# Altium project QUTMS-AMU-2021.PrjPcb (part 1 of 3)
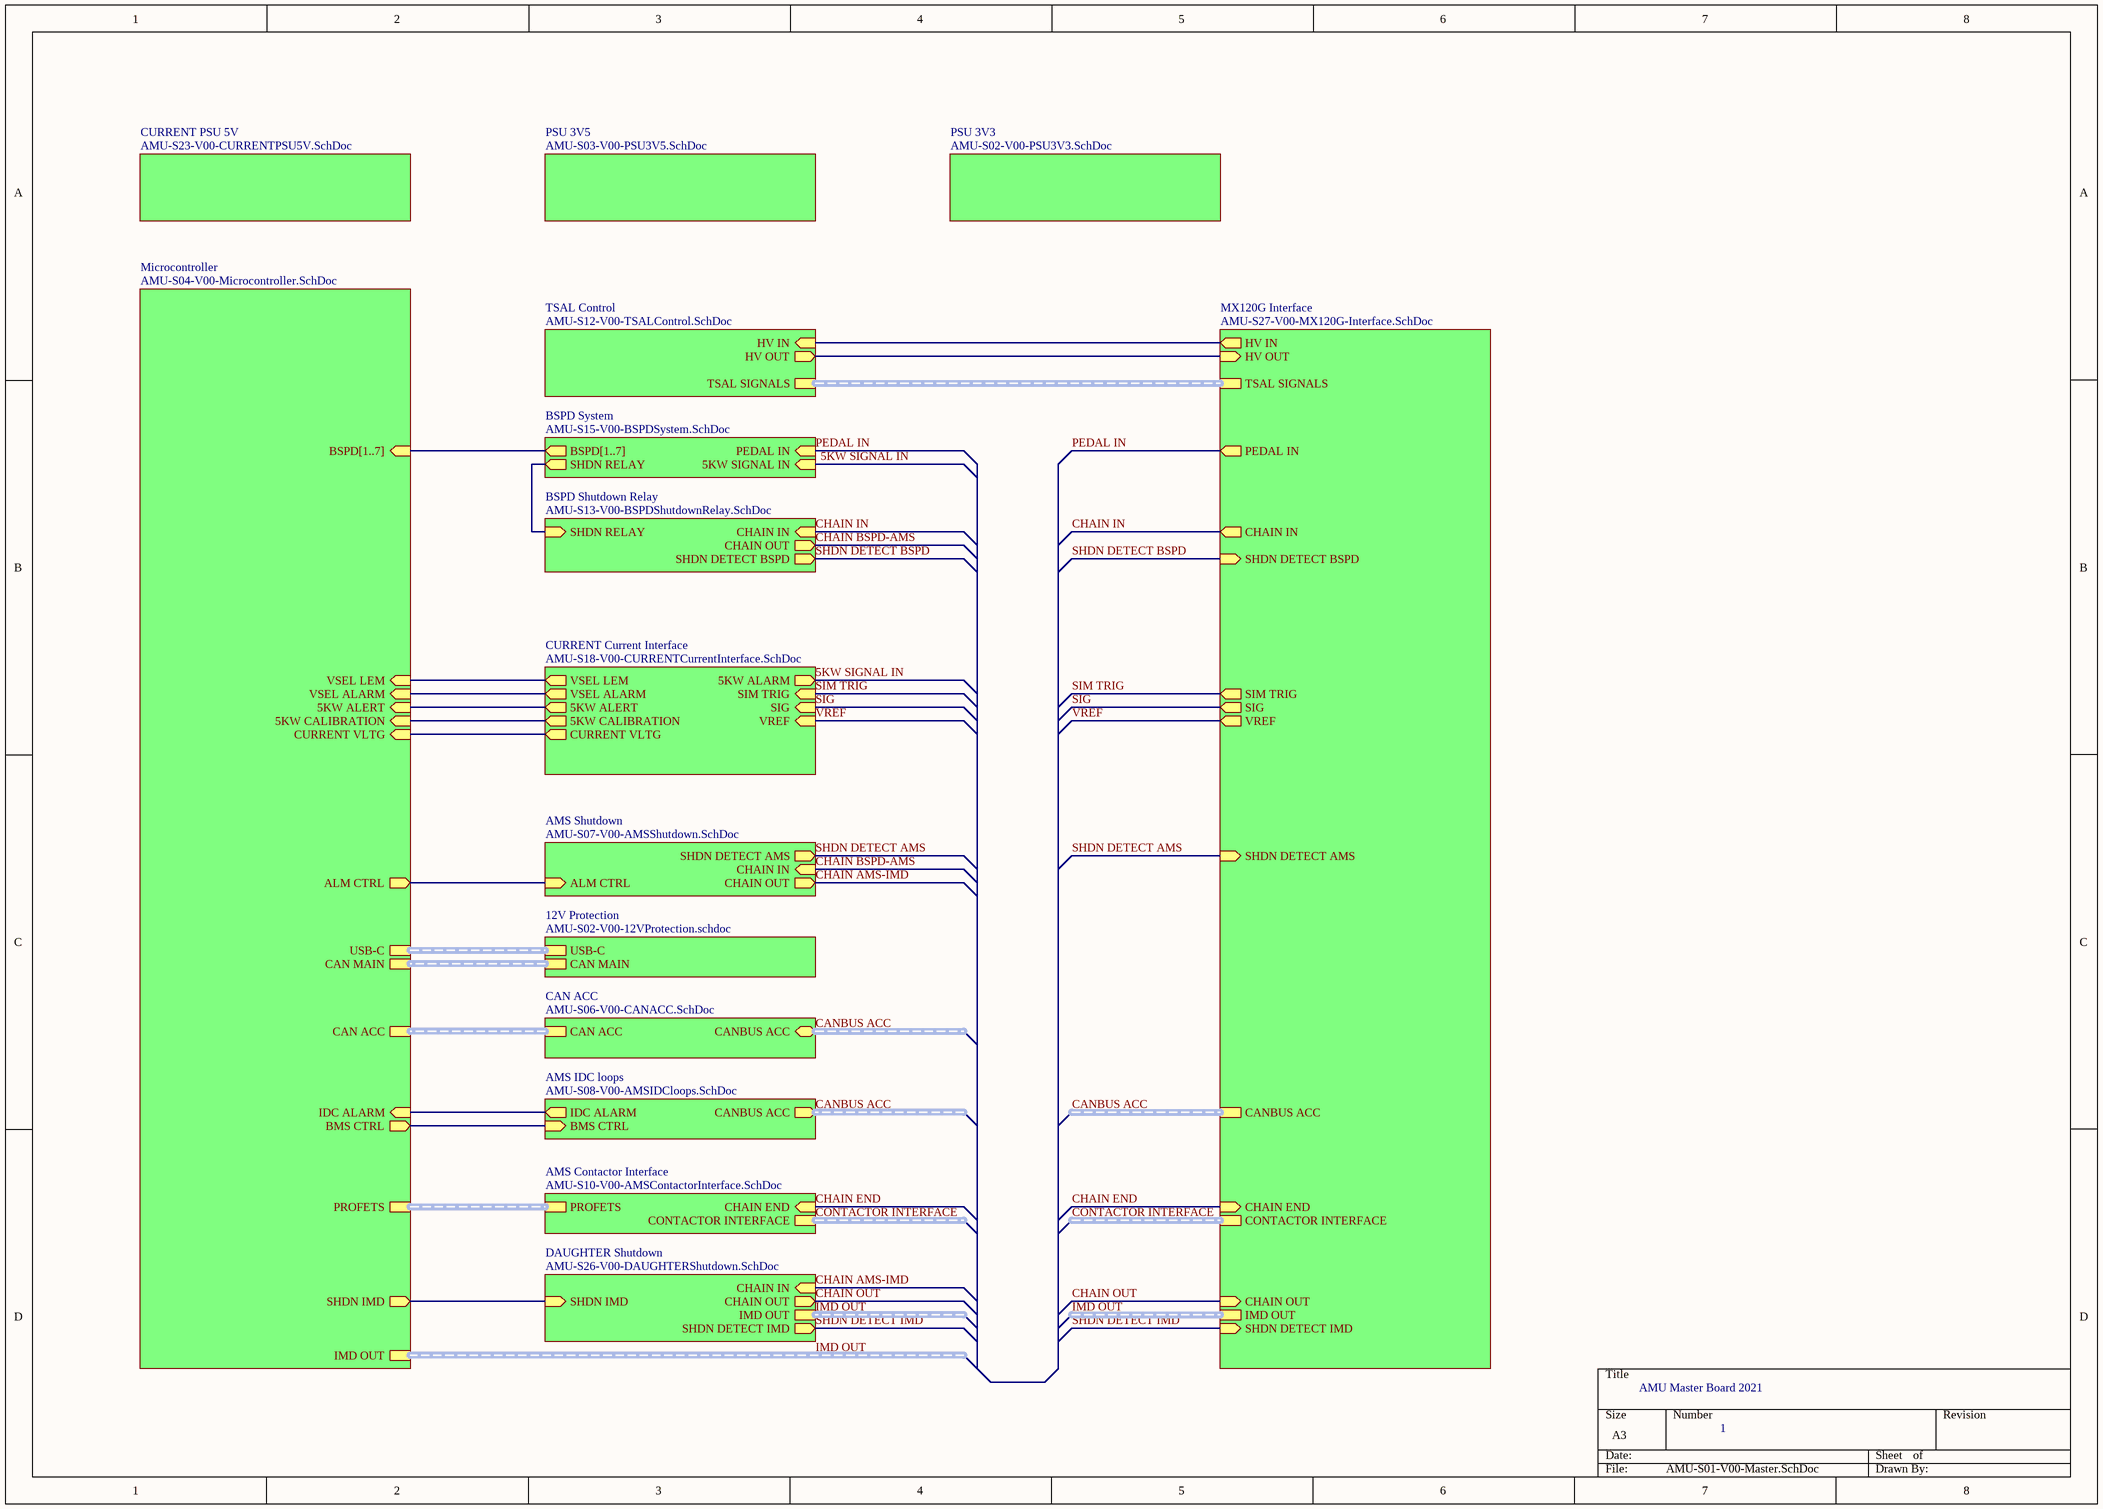
[diagram p0: AMU-S01-V00-Master.SchDoc]
25 sheets, 336 parts. Net scope: hierarchical (ports join the sheet entries above them; power ports are global).
Board file: AMU-2021-P01-V00.PcbDoc
Sheets:
  AMU-S01-V00-Master.SchDoc
    PSU 3V3 = AMU-S02-V00-PSU3V3.SchDoc
    PSU 3V5 = AMU-S03-V00-PSU3V5.SchDoc
    CAN ACC = AMU-S06-V00-CANACC.SchDoc
    AMS Contactor Interface = AMU-S10-V00-AMSContactorInterface.SchDoc
      PROFET 1 = AMU-S11-V00-AMSPROFET.SchDoc
      PROFET 3 = AMU-S11-V00-AMSPROFET.SchDoc
      PROFET 2 = AMU-S11-V00-AMSPROFET.SchDoc
    Microcontroller = AMU-S04-V00-Microcontroller.SchDoc
    CURRENT PSU 5V = AMU-S23-V00-CURRENTPSU5V.SchDoc
    AMS Shutdown = AMU-S07-V00-AMSShutdown.SchDoc
    DAUGHTER Shutdown = AMU-S26-V00-DAUGHTERShutdown.SchDoc
    TSAL Control = AMU-S12-V00-TSALControl.SchDoc
    MX120G Interface = AMU-S27-V00-MX120G-Interface.SchDoc
    BSPD Shutdown Relay = AMU-S13-V00-BSPDShutdownRelay.SchDoc
    BSPD System = AMU-S15-V00-BSPDSystem.SchDoc
      BSPD Delay = AMU-S16-V00-BSPDDelay.SchDoc
      BSPD Window Comparitor = AMU-S17-V00-BSPDWindowComparitor.SchDoc
      BSPD Window Comparitor = AMU-S17-V00-BSPDWindowComparitor.SchDoc
    CURRENT Current Interface = AMU-S18-V00-CURRENTCurrentInterface.SchDoc
      CURRENT 5kW Simulation = AMU-S19-V00-CURRENT5kWSimulation.SchDoc
      CURRENT LEM Interface = AMU-S20-V00-CURRENTLEMInterface.SchDoc
      CURRENT 5kW Detection = AMU-S21-V00-CURRENT5kWDetection.SchDoc
      CURRENT 5kW Alarm = AMU-S22-V00-CURRENT5kWAlarm.SchDoc
    12V Protection = AMU-S02-V00-12VProtection.schdoc
    AMS IDC loops = AMU-S08-V00-AMSIDCloops.SchDoc
  AMU-S05-V00-CANMAIN.SchDoc
  AMU-S28-V00-USBCProtection.SchDoc

## Sheet AMU-S01-V00-Master.SchDoc
size A3; SheetNumber: 1; SheetTotal: 25

### Sub-sheets
12V Protection = AMU-S02-V00-12VProtection.schdoc: USB-C (harness USB-C), CAN MAIN (harness CAN MAIN)
AMS Contactor Interface = AMU-S10-V00-AMSContactorInterface.SchDoc: PROFETS (harness PROFETS), CONTACTOR INTERFACE (harness CONTACTOR INTERFACE), CHAIN END (in)
AMS IDC loops = AMU-S08-V00-AMSIDCloops.SchDoc: IDC ALARM (out), BMS CTRL (in), CANBUS ACC (out, harness CANBUS4)
AMS Shutdown = AMU-S07-V00-AMSShutdown.SchDoc: ALM CTRL (in), CHAIN OUT (out), CHAIN IN (in), SHDN DETECT AMS (out)
BSPD Shutdown Relay = AMU-S13-V00-BSPDShutdownRelay.SchDoc: CHAIN OUT (out), CHAIN IN (in), SHDN RELAY (in), SHDN DETECT BSPD (out)
BSPD System = AMU-S15-V00-BSPDSystem.SchDoc: PEDAL IN (in), 5KW SIGNAL IN (in), SHDN RELAY (out), BSPD[1..7] (out)
CAN ACC = AMU-S06-V00-CANACC.SchDoc: CANBUS ACC (bidir, harness CANBUS4), CAN ACC (harness CAN4)
CURRENT Current Interface = AMU-S18-V00-CURRENTCurrentInterface.SchDoc: 5KW CALIBRATION (out), 5KW ALARM (out), CURRENT VLTG (out), 5KW ALERT (out), VSEL LEM (out), SIM TRIG (in), VSEL ALARM (out), SIG (in), VREF (in)
CURRENT PSU 5V = AMU-S23-V00-CURRENTPSU5V.SchDoc: no entries
DAUGHTER Shutdown = AMU-S26-V00-DAUGHTERShutdown.SchDoc: SHDN IMD (in), IMD OUT (harness IMD OUT), CHAIN OUT (out), CHAIN IN (in), SHDN DETECT IMD (out)
Microcontroller = AMU-S04-V00-Microcontroller.SchDoc: PROFETS (harness PROFETS), CAN MAIN (harness CAN MAIN), CAN ACC (harness CAN ACC), ALM CTRL (out), IDC ALARM (in), BMS CTRL (out), SHDN IMD (out), BSPD[1..7] (in), IMD OUT (harness IMD OUT), CURRENT VLTG (in), 5KW ALERT (in), VSEL ALARM (in), VSEL LEM (in), 5KW CALIBRATION (in), USB-C (harness USB-C)
MX120G Interface = AMU-S27-V00-MX120G-Interface.SchDoc: CANBUS ACC (harness CANBUS ACC), CONTACTOR INTERFACE (harness CONTACTOR INTERFACE), IMD OUT (harness IMD OUT), SIM TRIG (out), HV IN (out), HV OUT (in), CHAIN OUT (in), CHAIN IN (out), PEDAL IN (out), CHAIN END (in), TSAL SIGNALS (harness TSAL SIGNALS), SIG (out), VREF (out), SHDN DETECT BSPD (in), SHDN DETECT IMD (in), SHDN DETECT AMS (in)
PSU 3V3 = AMU-S02-V00-PSU3V3.SchDoc: no entries
PSU 3V5 = AMU-S03-V00-PSU3V5.SchDoc: no entries
TSAL Control = AMU-S12-V00-TSALControl.SchDoc: TSAL SIGNALS (harness TSAL SIGNALS), HV IN (in), HV OUT (out)

### Nets
5kW ALERT: sheet Microcontroller/5KW ALERT, sheet CURRENT Current Interface/5KW ALERT
5kW CALIBRATION: sheet Microcontroller/5KW CALIBRATION, sheet CURRENT Current Interface/5KW CALIBRATION
5KW SIGNAL IN: sheet BSPD System/5KW SIGNAL IN, sheet CURRENT Current Interface/5KW ALARM  [project net 5kW ALARM]
ALM CTRL: sheet Microcontroller/ALM CTRL, sheet AMS Shutdown/ALM CTRL
BMS CTRL: sheet Microcontroller/BMS CTRL, sheet AMS IDC loops/BMS CTRL
BSPD6: sheet BSPD Shutdown Relay/SHDN RELAY, sheet BSPD System/SHDN RELAY
CHAIN AMS-IMD: sheet AMS Shutdown/CHAIN OUT, sheet DAUGHTER Shutdown/CHAIN IN
CHAIN BSPD-AMS: sheet AMS Shutdown/CHAIN IN, sheet BSPD Shutdown Relay/CHAIN OUT
CHAIN END: sheet AMS Contactor Interface/CHAIN END, sheet MX120G Interface/CHAIN END
CHAIN IN: sheet MX120G Interface/CHAIN IN, sheet BSPD Shutdown Relay/CHAIN IN
CHAIN OUT: sheet DAUGHTER Shutdown/CHAIN OUT, sheet MX120G Interface/CHAIN OUT
CURRENT VLTG: sheet Microcontroller/CURRENT VLTG, sheet CURRENT Current Interface/CURRENT VLTG
HV IN: sheet TSAL Control/HV IN, sheet MX120G Interface/HV IN
HV OUT: sheet TSAL Control/HV OUT, sheet MX120G Interface/HV OUT
IDC ALARM: sheet Microcontroller/IDC ALARM, sheet AMS IDC loops/IDC ALARM
IMD OUT.IMD STATUS: sheet Microcontroller/SHDN IMD, sheet DAUGHTER Shutdown/SHDN IMD
PEDAL IN: sheet MX120G Interface/PEDAL IN, sheet BSPD System/PEDAL IN
SHDN DETECT AMS: sheet AMS Shutdown/SHDN DETECT AMS, sheet MX120G Interface/SHDN DETECT AMS
SHDN DETECT BSPD: sheet MX120G Interface/SHDN DETECT BSPD, sheet BSPD Shutdown Relay/SHDN DETECT BSPD
SHDN DETECT IMD: sheet DAUGHTER Shutdown/SHDN DETECT IMD, sheet MX120G Interface/SHDN DETECT IMD
SIG: sheet MX120G Interface/SIG, sheet CURRENT Current Interface/SIG  [project net LEM SIG]
SIM TRIG: sheet MX120G Interface/SIM TRIG, sheet CURRENT Current Interface/SIM TRIG
VREF: sheet MX120G Interface/VREF, sheet CURRENT Current Interface/VREF  [project net LEM REF]
NetR54_1: sheet Microcontroller/VSEL LEM, sheet CURRENT Current Interface/VSEL LEM
NetR67_1: sheet Microcontroller/VSEL ALARM, sheet CURRENT Current Interface/VSEL ALARM

### Buses and harness runs
bus sheet BSPD System/BSPD[1..7] = sheet Microcontroller/BSPD[1..7]
harness CANBUS ACC = sheet AMS IDC loops/CANBUS ACC
harness CANBUS ACC = sheet CAN ACC/CANBUS ACC
harness CANBUS ACC = sheet MX120G Interface/CANBUS ACC
harness CONTACTOR INTERFACE = sheet AMS Contactor Interface/CONTACTOR INTERFACE
harness CONTACTOR INTERFACE = sheet MX120G Interface/CONTACTOR INTERFACE
harness IMD OUT = sheet DAUGHTER Shutdown/IMD OUT
harness IMD OUT = sheet Microcontroller/IMD OUT
harness IMD OUT = sheet MX120G Interface/IMD OUT
harness sheet 12V Protection/CAN MAIN = sheet Microcontroller/CAN MAIN
harness sheet 12V Protection/USB-C = sheet Microcontroller/USB-C
harness sheet AMS Contactor Interface/PROFETS = sheet Microcontroller/PROFETS
harness sheet CAN ACC/CAN ACC = sheet Microcontroller/CAN ACC
harness sheet MX120G Interface/TSAL SIGNALS = sheet TSAL Control/TSAL SIGNALS

### Notes on the sheet
- AMU Master Board 2021
- 1

## Sheet AMU-S02-V00-PSU3V3.SchDoc: Power Supply (20-40V to 3v3 @ 0.1-0.6A)
size A3; DrawnBy: Jonn Dillon; DocumentNumber: 2; Revision: 01; SheetNumber: 2; SheetTotal: 31; Version: 01; Project: AMU 2020 (Sourced from BMS 2020); PageSetup: Record=PageOptions|CenterHorizontal=True|CenterVertical=True|PrintScale=0.97|XCorrection=1.00|YCorrection=1.00|PrintKind=0|BorderSize=5000000|LeftOffset=0|BottomOffset=0|Orientation=2|PaperLength=1000|PaperWidth=1000|Scale=100|PaperSource=7|PrintQuality=-4|MediaType=1|DitherType=10|PaperKind=A4|PrintScaleMode=1
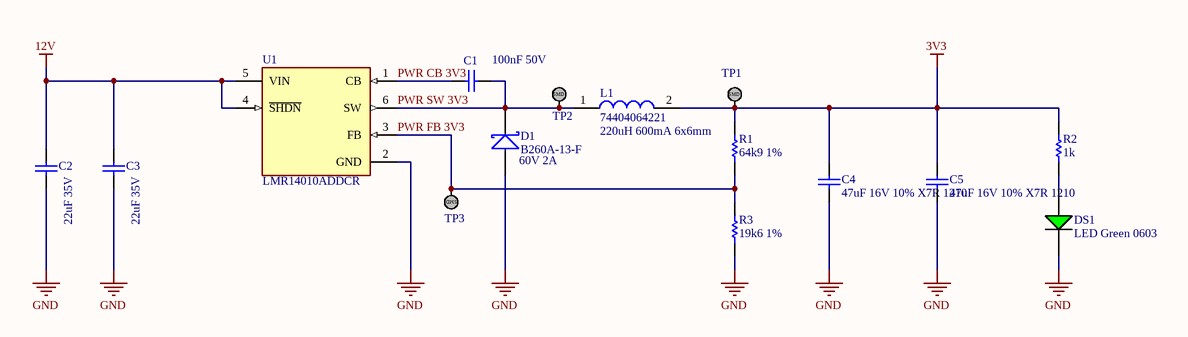
[diagram p1: AMU-S02-V00-PSU3V3.SchDoc]

### Parts
C1  100nF 50V  [Cap_Ceramic_0603]
C2  22uF 35V  [Cap_Ceramic_1206]
C3  22uF 35V  [Cap_Ceramic_1206]
C4  47uF 16V 10% X7R 1210  [Cap_Ceramic_1210]
C5  47uF 16V 10% X7R 1210  [Cap_Ceramic_1210]
D1  B260A-13-F  [SMA]
DS1  LED Green 0603  [LED GREEN 0603]
L1  74404064221  [Inductor_6x6mm]
R1  64k9 1%  [Res_ThinFilm_0603]
R2  1k  [Res_ThinFilm_0603]
R3  19k6 1%  [Res_ThinFilm_0603]
TP1  TestPoint_SMD  [TestPointSMD]  (value not drawn)
TP2  TestPoint_SMD  [TestPointSMD]  (value not drawn)
TP3  TestPoint_SMD  [TestPointSMD]  (value not drawn)
U1  LMR14010ADDCR  [FP-DDC0006A-MFG]

### Nets
3V3: C4.2 C5.2 L1.2 R1.2 R2.2 TP1.1
12V: C2.2 C3.2 U1.4(~{SHDN}) U1.5(VIN)  [project net HV ON]
GND: C2.1 C3.1 C4.1 C5.1 D1.A DS1.2(C) R3.1 U1.2(GND)
PWR CB 3V3: C1.1 U1.1(CB)
PWR FB 3V3: R1.1 R3.2 TP3.1 U1.3(FB)
PWR SW 3V3: C1.2 D1.K L1.1 TP2.1 U1.6(SW)
NetDS1_1: DS1.1(A) R2.1

### Notes on the sheet
- (near D1) 60V 2A
- (near L1) 220uH 600mA 6x6mm
- Revision History:
- Sheet Title:
- Rev
- Date
- Description
- Project:
- Size:
- Drawn By:
- A3
- Number:
- Revision:
- Sheet
- Version:
- of
- QUT Motorsport
- O-120, Gardens Point
- 2 George Street
- Brisbane, QLD 4000
- Australia
- Print Date:
- Print Time:
- File Name:
- (in symbol TestPoint_SMD) SMD

### Library data of the parts
C1 = 100nF 50V 5% X7R 0603: Capacitor, Ceramic, SMD, 100nF, 50V, 5%, X7R, 0603
C2 C3 = 22uF 35V 20% X5R 1206: 22µF ±20% 35V Ceramic Capacitor X5R 1206 (3216 Metric); ComponentLink1Description: Digikey; ComponentLink1URL: https://www.digikey.com.au/product-detail/en/tdk-corporation/C3216X5R1V226M160AC/445-8045-1-ND/2792165; ComponentLink2Description: Datasheet; ComponentLink2URL: https://product.tdk.com/info/en/catalog/datasheets/mlcc_commercial_general_en.pdf
C4 C5 = 47uF 16V 10% X7R 1210: Capacitor, Ceramic, SMD, 47uF, 16V, 5%, X7R, 1210
D1 = B260A-13-F: Diode, Schottky Barrier Rectifier, 60 V, 2 A, B260A-13-F
L1 = 74404064221: FIXED IND 220UH 660MA 850 MOHM; ComponentLink1Description: Digikey; ComponentLink1URL: https://www.digikey.com.au/product-detail/en/w%C3%BCrth-elektronik/74404064221/732-7261-1-ND/5353241; ComponentLink2Description: LCSC A; ComponentLink2URL: https://lcsc.com/product-detail/Power-Inductors_Sunlord-SWPA6045S221MT_C91047.html; ComponentLink3Description: LCSC B; ComponentLink3URL: https://lcsc.com/product-detail/Power-Inductors_SXN-Shun-Xiang-Nuo-Elec-SMNR6045-221MT_C467145.html
R1 = 64k9 1% 0603: Resistor, SMD, 64k9, 0.1W, 5%, 0603
R2 = 1k 5% 0603: Resistor, SMD, 1k, 0.1W, 5%, 0603
R3 = 19k6 1% 0603: Resistor, SMD, 19k6, 0.1W, 5%, 0603
U1 = CMP-04918-000056-1: IC REG BUCK ADJ 1A TSOT23-6; Manufacturer: Texas Instruments; Max Junction Temp: +125°C; Number Of Outputs: 1; Standoff Height: 0mm; Switching Frequency: 700kHz; Min Supply Voltage: 4V; Max Supply Voltage: 40V; Max Duty Cycle: 96%; Output Type: AdjustableProgrammable; Manufacturer Part Number: LMR14010ADDCR; Temperature: -40°C to +125°C; Output Current: 1A; Category: IC; Temperature Range High: +125°C; Lead Free: Yes; Switching Topology: Buck; Mouser Description: 4-V to 40-V, 1-A Step-Down Converter With High Efficiency Eco-Mode 6-SOT-23-THIN -40 to 125; Device Class L1: Integrated Circuits (ICs); Digikey Description: IC REG BUCK ADJ 1A TSOT23-6; Package: DDC0006A; Ipc Land Pattern Name: SOT95P280X110-6; Device Class L2: Power Management ICs; Temperature Range Low: -40°C; Height: 1.1mm; Device Class L3: Voltage Regulators - Switching; RoHS: TRUE; Automotive: No; Octopart: https://octopart.com/lmr14010addcr-texas+instruments-90753290; ComponentLink2URL: https://www.ti.com/lit/ds/symlink/lmr14010a.pdf; ComponentLink2Description: Datasheet

## Sheet AMU-S03-V00-PSU3V5.SchDoc: Power Supply (20-40V to 3v3 @ 0.1-0.6A)
size A3; DrawnBy: Jonn Dillon; DocumentNumber: 3; SheetNumber: 3; SheetTotal: 23; Version: 00; Project: AMU 2020 (Sourced from BMS 2020); PageSetup: Record=PageOptions|CenterHorizontal=True|CenterVertical=True|PrintScale=0.97|XCorrection=1.00|YCorrection=1.00|PrintKind=0|BorderSize=5000000|LeftOffset=0|BottomOffset=0|Orientation=2|PaperLength=1000|PaperWidth=1000|Scale=100|PaperSource=7|PrintQuality=-4|MediaType=1|DitherType=10|PaperKind=A4|PrintScaleMode=1
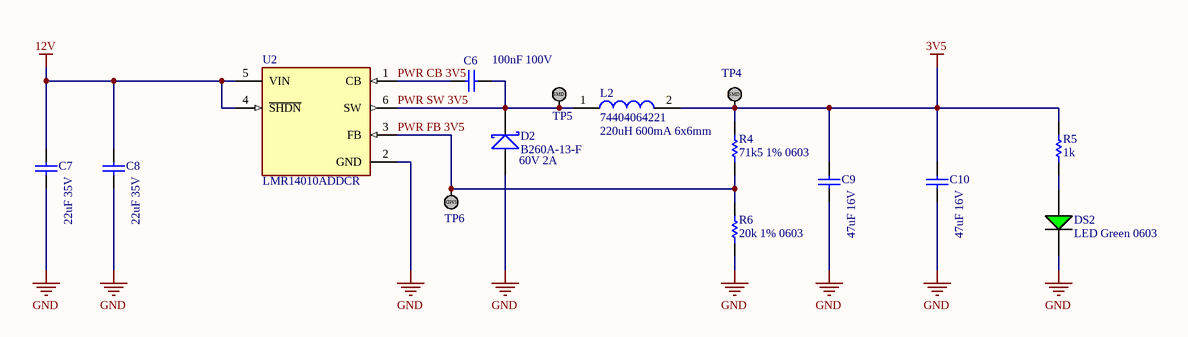
[diagram p2: AMU-S03-V00-PSU3V5.SchDoc]

### Parts
C6  100nF 100V  [Cap_Ceramic_0603]
C7  22uF 35V  [Cap_Ceramic_1206]
C8  22uF 35V  [Cap_Ceramic_1206]
C9  47uF 16V  [Cap_Ceramic_0603]
C10  47uF 16V  [Cap_Ceramic_0603]
D2  B260A-13-F  [SMA]
DS2  LED Green 0603  [LED GREEN 0603]
L2  74404064221  [Inductor_6x6mm]
R4  71k5 1% 0603  [Res_ThinFilm_0603]
R5  1k  [Res_ThinFilm_0603]
R6  20k 1% 0603  [Res_ThinFilm_0603]
TP4  TestPoint_SMD  [TestPointSMD]  (value not drawn)
TP5  TestPoint_SMD  [TestPointSMD]  (value not drawn)
TP6  TestPoint_SMD  [TestPointSMD]  (value not drawn)
U2  LMR14010ADDCR  [FP-DDC0006A-MFG]

### Nets
3V5: C9.2 C10.2 L2.2 R4.2 R5.2 TP4.1
12V: C7.2 C8.2 U2.4(~{SHDN}) U2.5(VIN)  [project net HV ON]
GND: C7.1 C8.1 C9.1 C10.1 D2.A DS2.2(C) R6.1 U2.2(GND)
PWR CB 3V5: C6.1 U2.1(CB)
PWR FB 3V5: R4.1 R6.2 TP6.1 U2.3(FB)
PWR SW 3V5: C6.2 D2.K L2.1 TP5.1 U2.6(SW)
NetDS2_1: DS2.1(A) R5.1

### Notes on the sheet
- (near D2) 60V 2A
- (near L2) 220uH 600mA 6x6mm
- Revision History:
- Sheet Title:
- Rev
- Date
- Description
- Project:
- Size:
- Drawn By:
- A3
- Number:
- Revision:
- Sheet
- Version:
- of
- QUT Motorsport
- O-120, Gardens Point
- 2 George Street
- Brisbane, QLD 4000
- Australia
- Print Date:
- Print Time:
- File Name:
- (in symbol TestPoint_SMD) SMD

### Library data of the parts
C6 = 100nF 100V 5% X7R 0603: Capacitor, Ceramic, SMD, 100nF, 100V, 5%, X7R, 0603
C7 C8 = 22uF 35V 20% X5R 1206: as C2 on sheet AMU-S02-V00-PSU3V3; ComponentLink1Description: Digikey; ComponentLink1URL: https://www.digikey.com.au/product-detail/en/tdk-corporation/C3216X5R1V226M160AC/445-8045-1-ND/2792165; ComponentLink2Description: Datasheet; ComponentLink2URL: https://product.tdk.com/info/en/catalog/datasheets/mlcc_commercial_general_en.pdf
C9 C10 = 47uF 16V 10% X7R 1210: as C4 on sheet AMU-S02-V00-PSU3V3
D2 = B260A-13-F: as D1 on sheet AMU-S02-V00-PSU3V3
L2 = 74404064221: FIXED IND 220UH 660MA 850 MOHM; ComponentLink1Description: Digikey; ComponentLink1URL: https://www.digikey.com.au/product-detail/en/w%C3%BCrth-elektronik/74404064221/732-7261-1-ND/5353241; ComponentLink2Description: LCSC A; ComponentLink2URL: https://lcsc.com/product-detail/Power-Inductors_Sunlord-SWPA6045S221MT_C91047.html; ComponentLink3Description: LCSC B; ComponentLink3URL: https://lcsc.com/product-detail/Power-Inductors_SXN-Shun-Xiang-Nuo-Elec-SMNR6045-221MT_C467145.html
R4 = 71k5 1% 0603: Resistor, SMD, 71k5, 0.1W, 1%, 0603
R5 = 1k 5% 0603: Resistor, SMD, 1k, 0.1W, 5%, 0603
R6 = 20k 1% 0603: Resistor, SMD, 20k, 0.1W, 1%, 0603
U2 = CMP-04918-000056-1: as U1 on sheet AMU-S02-V00-PSU3V3; Manufacturer Part Number: LMR14010ADDCR; Temperature: -40°C to +125°C; Output Current: 1A; Category: IC; Temperature Range High: +125°C; Lead Free: Yes; Switching Topology: Buck; Mouser Description: 4-V to 40-V, 1-A Step-Down Converter With High Efficiency Eco-Mode 6-SOT-23-THIN -40 to 125; Device Class L1: Integrated Circuits (ICs); Digikey Description: IC REG BUCK ADJ 1A TSOT23-6; Package: DDC0006A; Ipc Land Pattern Name: SOT95P280X110-6; Device Class L2: Power Management ICs; Temperature Range Low: -40°C; Height: 1.1mm; Device Class L3: Voltage Regulators - Switching; RoHS: TRUE; Automotive: No; Octopart: https://octopart.com/lmr14010addcr-texas+instruments-90753290; ComponentLink2URL: https://www.ti.com/lit/ds/symlink/lmr14010a.pdf; ComponentLink2Description: Datasheet

## Sheet AMU-S06-V00-CANACC.SchDoc: Isolated CANBUS4 3V3
size A3; DrawnBy: Jonn Dillon; DocumentNumber: 6; Revision: 01; SheetNumber: 6; SheetTotal: 25; Version: 01; Project: AMU 2020 (Sourced from BMS 2020); PageSetup: Record=PageOptions|CenterHorizontal=True|CenterVertical=True|PrintScale=0.97|XCorrection=1.00|YCorrection=1.00|PrintKind=0|BorderSize=5000000|LeftOffset=0|BottomOffset=0|Orientation=2|PaperLength=1000|PaperWidth=1000|Scale=100|PaperSource=7|PrintQuality=-4|MediaType=1|DitherType=10|PaperKind=A4|PrintScaleMode=1
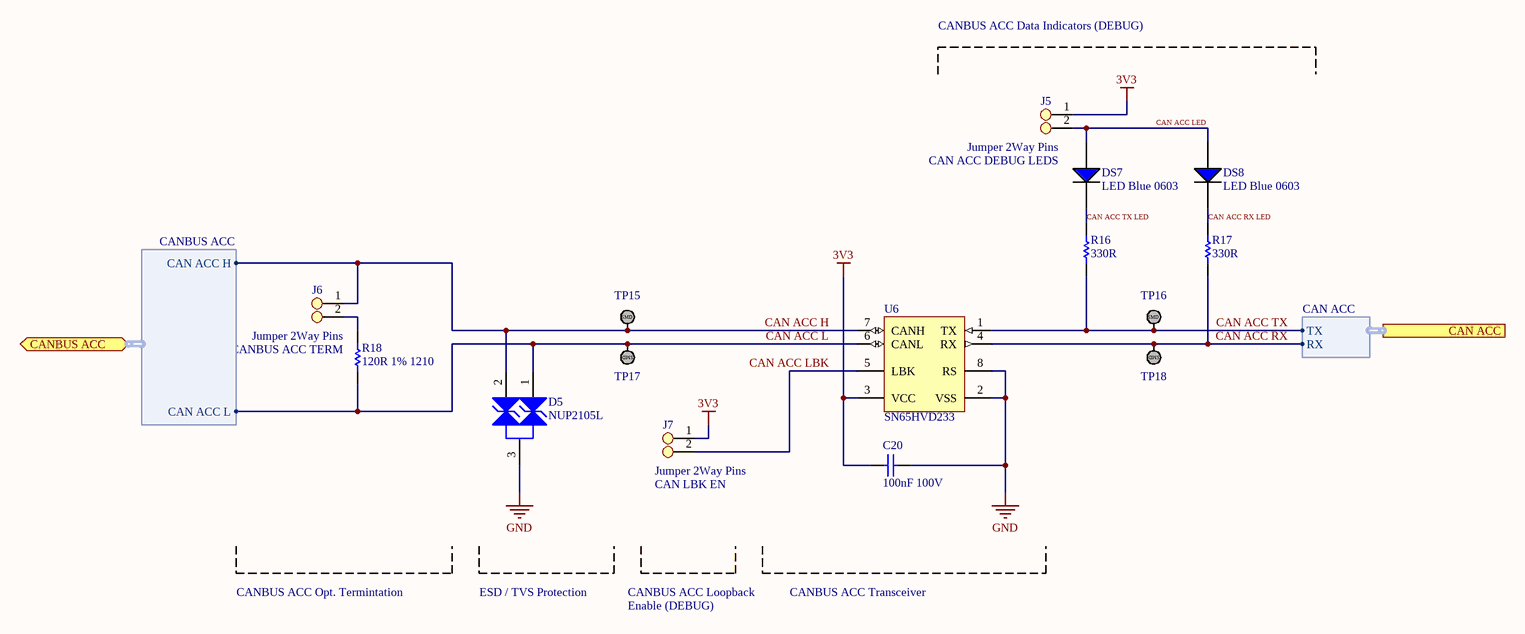
[diagram p3: AMU-S06-V00-CANACC.SchDoc]

### Parts
C20  100nF 100V  [Cap_Ceramic_0603]
D5  NUP2105L  [NUP2105L]
DS7  LED Blue 0603  [LED BLUE 0603]
DS8  LED Blue 0603  [LED BLUE 0603]
J5  Jumper 2Way Pins  [Jumper_2Way_Pin]
J6  Jumper 2Way Pins  [Jumper_2Way_Pin]
J7  Jumper 2Way Pins  [Jumper_2Way_Pin]
R16  330R  [Res_ThinFilm_0603]
R17  330R  [Res_ThinFilm_0603]
R18  120R 1% 1210  [Res_ThinFilm_1210]
TP15  TestPoint_SMD  [TestPointSMD]  (value not drawn)
TP16  TestPoint_SMD  [TestPointSMD]  (value not drawn)
TP17  TestPoint_SMD  [TestPointSMD]  (value not drawn)
TP18  TestPoint_SMD  [TestPointSMD]  (value not drawn)
U6  SN65HVD233  [SN65HVD233DR]

### Ports
CAN ACC (harness CAN ACC), CANBUS ACC (bidir, harness CANBUS ACC)

### Harnesses
CANBUS ACC: CAN ACC H, CAN ACC L
CAN ACC: RX, TX

### Nets
3V3: C20.2 J5.1 J7.1 U6.3(VCC)
GND: C20.1 D5.3 U6.2(VSS) U6.8(RS)
CAN ACC H: D5.2 J6.1 TP15.1 U6.7(CANH) ; port CANBUS ACC.CAN ACC H
CAN ACC L: D5.1 R18.1 TP17.1 U6.6(CANL) ; port CANBUS ACC.CAN ACC L
CAN ACC LBK: J7.2 U6.5(LBK)
CAN ACC LED: DS7.1(A) DS8.1(A) J5.2
CAN ACC RX: R17.1 TP18.1 U6.4(RX) ; port CAN ACC.RX
CAN ACC RX LED: DS8.2(C) R17.2
CAN ACC TX: R16.1 TP16.1 U6.1(TX) ; port CAN ACC.TX
CAN ACC TX LED: DS7.2(C) R16.2
NetJ6_2: J6.2 R18.2

### Notes on the sheet
- CANBUS ACC Data Indicators (DEBUG)
- CAN ACC DEBUG LEDS
- (near R18) CANBUS ACC TERM
- (near J7) CAN LBK EN
- CANBUS ACC Opt. Termintation
- ESD / TVS Protection
- CANBUS ACC Loopback
- Enable (DEBUG)
- CANBUS ACC Transceiver
- Revision History:
- Sheet Title:
- Rev
- Date
- Description
- Project:
- Size:
- Drawn By:
- A3
- Number:
- Revision:
- Sheet
- Version:
- of
- QUT Motorsport
- O-120, Gardens Point
- 2 George Street
- Brisbane, QLD 4000
- Australia
- Print Date:
- Print Time:
- File Name:
- (in symbol TestPoint_SMD) SMD

### Library data of the parts
C20 = 100nF 100V 5% X7R 0603: as C6 on sheet AMU-S03-V00-PSU3V5
J5-J7 = Jumper 2Way Side Pins
R16 R17 = 330R 5% 0603: Resistor, SMD, 330R, 0.1W, 5%, 0603
R18 = 120R 1% 1210: Resistor, SMD, 120R, 0.25W, 1%, 1210
D5 = NUP2105L: ComponentLink1Description: Datasheet; ComponentLink1URL: https://www.onsemi.cn/PowerSolutions/document/NUP2105L-D.PDF; Parameter 1: *; ComponentLink2Description: LCSC; ComponentLink2URL: https://lcsc.com/product-detail/TVS_ON-Semiconductor-NUP2105LT1G_C14486.html; ComponentLink3Description: Digikey; ComponentLink3URL: https://www.digikey.com.au/product-detail/en/on-semiconductor/SZNUP2105LT1G/SZNUP2105LT1GOSCT-ND/3487669
U6 = SN65HVD233: ComponentLink1Description: LCSC; ComponentLink1URL: https://lcsc.com/product-detail/CAN-ICs_Texas-Instruments_SN65HVD233DRG4_Texas-Instruments-Texas-Instruments-SN65HVD233DRG4_C61643.html; ComponentLink2Description: Digikey; ComponentLink2URL: https://www.digikey.com.au/product-detail/en/texas-instruments/SN65HVD233DR/296-35967-1-ND/4134960; ComponentLink3Description: Datasheet; ComponentLink3URL: https://www.ti.com/lit/ds/symlink/sn65hvd233.pdf?ts=1588560888178; ComponentLink4Description: Ti Product Page; ComponentLink4URL: https://www.ti.com/product/SN65HVD233

## Sheet AMU-S10-V00-AMSContactorInterface.SchDoc: Contactor Interface
size A3; DrawnBy: Thomas Benedetti; DocumentNumber: 11; SheetNumber: 9; SheetTotal: 25; Version: 00; Project: AMU 2020; PageSetup: Record=PageOptions|CenterHorizontal=True|CenterVertical=True|PrintScale=0.97|XCorrection=1.00|YCorrection=1.00|PrintKind=0|BorderSize=5000000|LeftOffset=0|BottomOffset=0|Orientation=2|PaperLength=1000|PaperWidth=1000|Scale=100|PaperSource=7|PrintQuality=-4|MediaType=1|DitherType=10|PaperKind=A4|PrintScaleMode=1
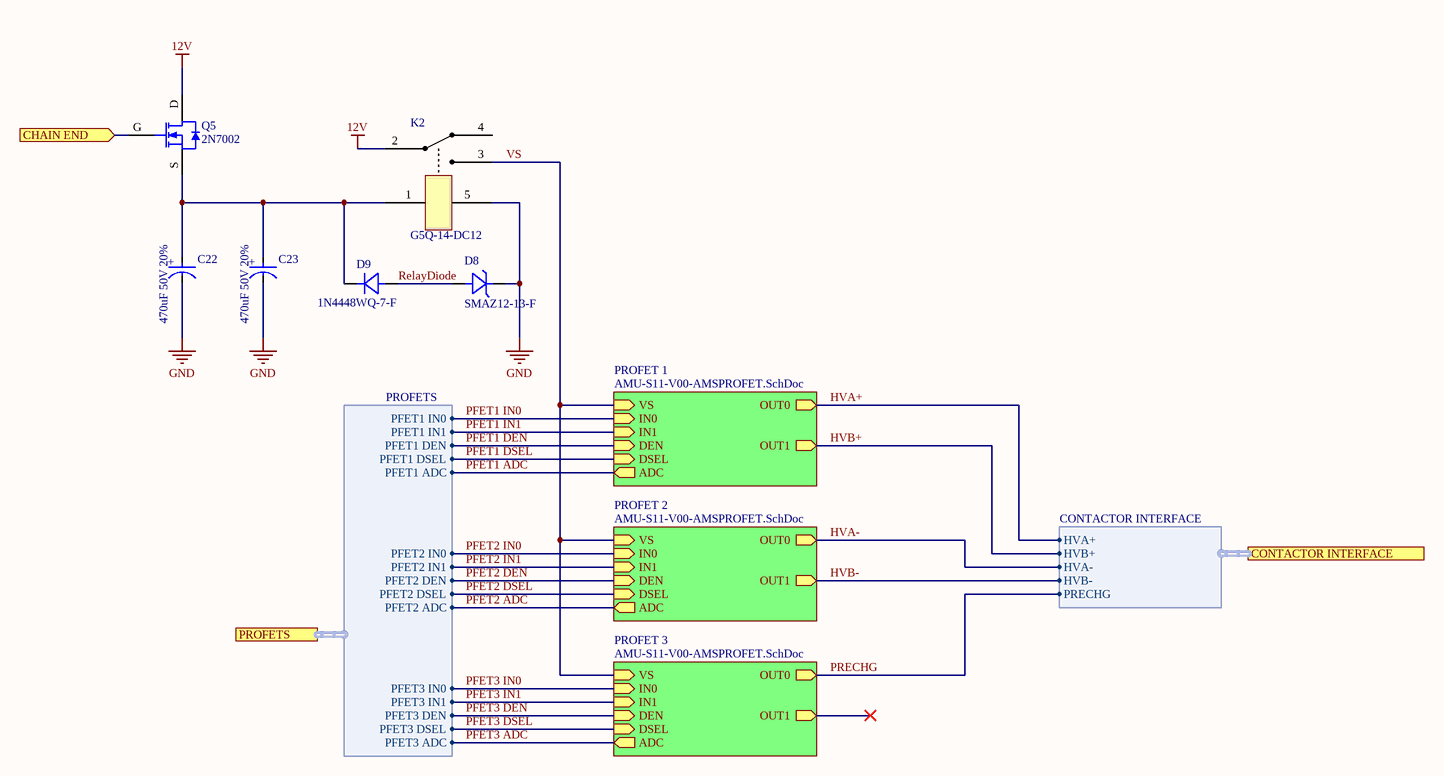
[diagram p4: AMU-S10-V00-AMSContactorInterface.SchDoc]

### Parts
C22  470uF 50V 20%  [CAP_ALU_TH]
C23  470uF 50V 20%  [CAP_ALU_TH]
D8  SMAZ12-13-F  [SMA]
D9  1N4448WQ-7-F  [SMA]
K2  G5Q-14-DC12  [G5Q-14]
Q5  2N7002  [SOT23-3]

### Sub-sheets
PROFET 1 = AMU-S11-V00-AMSPROFET.SchDoc: VS (in), ADC (out), DSEL (in), DEN (in), IN1 (in), IN0 (in), OUT1 (out), OUT0 (out)
PROFET 2 = AMU-S11-V00-AMSPROFET.SchDoc: VS (in), ADC (out), DSEL (in), DEN (in), IN1 (in), IN0 (in), OUT1 (out), OUT0 (out)
PROFET 3 = AMU-S11-V00-AMSPROFET.SchDoc: VS (in), ADC (out), DSEL (in), DEN (in), IN1 (in), IN0 (in), OUT1 (out), OUT0 (out)

### Ports
CHAIN END (in), CONTACTOR INTERFACE (harness CONTACTOR INTERFACE), PROFETS (harness PROFETS)

### Harnesses
PROFETS: PFET1 IN0, PFET1 IN1, PFET1 DEN, PFET1 DSEL, PFET1 ADC, PFET2 IN0, PFET2 IN1, PFET2 DEN, PFET2 DSEL, PFET2 ADC, PFET3 IN0, PFET3 DSEL, PFET3 ADC, PFET3 DEN, PFET3 IN1
CONTACTOR INTERFACE: HVA-, HVB+, HVA+, HVB-, PRECHG

### Nets
12V: K2.2 Q5.D  [project net HV ON]
GND: C22.K C23.K D8.K(Cathode) K2.5
CHAIN END: Q5.G ; port CHAIN END
HVA+: sheet PROFET 1/OUT0, port CONTACTOR INTERFACE.HVA+  [project net CONTACTOR INTERFACE.HVA+]
HVA-: sheet PROFET 2/OUT0, port CONTACTOR INTERFACE.HVA-  [project net CONTACTOR INTERFACE.HVA-]
HVB+: sheet PROFET 1/OUT1, port CONTACTOR INTERFACE.HVB+  [project net CONTACTOR INTERFACE.HVB+]
HVB-: sheet PROFET 2/OUT1, port CONTACTOR INTERFACE.HVB-  [project net CONTACTOR INTERFACE.HVB-]
PFET1 ADC: sheet PROFET 1/ADC, port PROFETS.PFET1 ADC
PFET1 DEN: sheet PROFET 1/DEN, port PROFETS.PFET1 DEN
PFET1 DSEL: sheet PROFET 1/DSEL, port PROFETS.PFET1 DSEL
PFET1 IN0: sheet PROFET 1/IN0, port PROFETS.PFET1 IN0
PFET1 IN1: sheet PROFET 1/IN1, port PROFETS.PFET1 IN1
PFET2 ADC: sheet PROFET 2/ADC, port PROFETS.PFET2 ADC
PFET2 DEN: sheet PROFET 2/DEN, port PROFETS.PFET2 DEN
PFET2 DSEL: sheet PROFET 2/DSEL, port PROFETS.PFET2 DSEL
PFET2 IN0: sheet PROFET 2/IN0, port PROFETS.PFET2 IN0
PFET2 IN1: sheet PROFET 2/IN1, port PROFETS.PFET2 IN1
PFET3 ADC: sheet PROFET 3/ADC, port PROFETS.PFET3 ADC
PFET3 DEN: sheet PROFET 3/DEN, port PROFETS.PFET3 DEN
PFET3 DSEL: sheet PROFET 3/DSEL, port PROFETS.PFET3 DSEL
PFET3 IN0: sheet PROFET 3/IN0, port PROFETS.PFET3 IN0
PFET3 IN1: sheet PROFET 3/IN1, port PROFETS.PFET3 IN1
PRECHG: sheet PROFET 3/OUT0, port CONTACTOR INTERFACE.PRECHG  [project net CONTACTOR INTERFACE.PRECHG]
RelayDiode: D8.A(Anode) D9.A(Anode)
VS: K2.3 ; sheet PROFET 1/VS, sheet PROFET 3/VS, sheet PROFET 2/VS
NetC22_A: C22.A C23.A D9.K(Cathode) K2.1 Q5.S

Not connected (* = marked no-connect by the designer): K2 4

### Notes on the sheet
- Revision History:
- Sheet Title:
- Rev
- Date
- Description
- Project:
- Size:
- Drawn By:
- A3
- Number:
- Revision:
- Sheet
- Version:
- of
- QUT Motorsport
- O-120, Gardens Point
- 2 George Street
- Brisbane, QLD 4000
- Australia
- Print Date:
- Print Time:
- File Name:
- (in symbol 470uF 50V 20% Alum E-CAP) +

### Library data of the parts
C22 C23 = 470uF 50V 20% Alum E-CAP: 470µF 50V Aluminum Electrolytic Capacitors Radial, Can  5000 Hrs @ 105°C
D8 = SMAZ12-13-F: Zener Diode 12V 1W ±5% Surface Mount SMA; Manufacturer: ON Semiconductor; MPN: MM3Z56VB; ComponentLink1Description: Digikey; ComponentLink1URL: https://www.digikey.com.au/product-detail/en/diodes-incorporated/SMAZ12-13-F/SMAZ12-FDICT-ND/725073; ComponentLink2Description: Datasheet; ComponentLink2URL: https://www.diodes.com/assets/Datasheets/ds18015.pdf
D9 = 1N4448WQ-7-F: Diode, SMD, 75V, 5%, 250mA, SOD123; Manufacturer: ON Semiconductor / Fairchild; Manufacturer Part Number: 1N914BWS; Average Rectified Current: 150mA; Element Configuration: Single; Forward Voltage: 1V; Max Reverse Leakage Current: 5uA; Power Dissipation: 200mW; Recovery Time: 4ns; Max Forward Surge Current (Ifsm): 4A; Parameter 1: *; Weight: 0.0276g; Category: Rectifier Diodes; Contact Plating: Tin,Matte; Forward Current: 150mA; Lead Free: Lead Free; Max Operating Temperature: 150°C; Max Repetitive Reverse Voltage (Vrrm): 75V; Max Reverse Voltage (DC): 75V; Min Operating Temperature: -55°C; Mount: Surface Mount; Number of Pins: 2; Package Quantity: 1; Packaging: Tape and Reel; Peak Reverse Current: 5uA; Radiation Hardening: No; REACH SVHC: No SVHC; Reverse Recovery Time: 4ns; Height: 1mm; Length: 1.8mm; Reverse Voltage: 75V; Width: 1.35mm
K2 = G5Q-14-DC12: General Purpose Relay SPDT (1 Form C) 12VDC Coil Through Hole, 12V, 16A

## Sheet AMU-S11-V00-AMSPROFET.SchDoc
size A3; DocumentNumber: 12; SheetNumber: 10; SheetTotal: 25; Version: 00; Project: ####; PageSetup: Record=PageOptions|CenterHorizontal=True|CenterVertical=True|PrintScale=0.97|XCorrection=1.00|YCorrection=1.00|PrintKind=0|BorderSize=5000000|LeftOffset=0|BottomOffset=0|Orientation=2|PaperLength=1000|PaperWidth=1000|Scale=100|PaperSource=7|PrintQuality=-4|MediaType=1|DitherType=10|PaperKind=A4|PrintScaleMode=1
Used 3 times, as channels AMS Contactor Interface/PROFET 1, AMS Contactor Interface/PROFET 3, AMS Contactor Interface/PROFET 2. Parts and nets are listed once, with the designators drawn on the sheet.
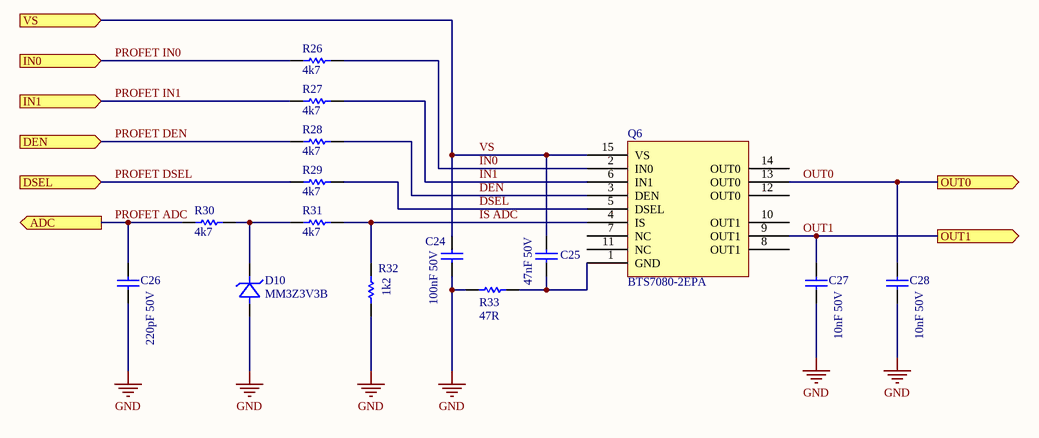
[diagram p5: AMU-S11-V00-AMSPROFET.SchDoc]

### Parts
C24  100nF 50V  [Cap_Ceramic_0603]
C25  47nF 50V  [Cap_Ceramic_0603]
C26  220pF 50V  [Cap_Ceramic_0603]
C27  10nF 50V  [Cap_Ceramic_0603]
C28  10nF 50V  [Cap_Ceramic_0603]
D10  MM3Z3V3B  [SOD-323F]
Q6  BTS7080-2EPA  [BTS7008-2EPZ]
R26  4k7  [Res_ThinFilm_0603]
R27  4k7  [Res_ThinFilm_0603]
R28  4k7  [Res_ThinFilm_0603]
R29  4k7  [Res_ThinFilm_0603]
R30  4k7  [Res_ThinFilm_0603]
R31  4k7  [Res_ThinFilm_0603]
R32  1k2  [Res_ThinFilm_0603]
R33  47R  [Res_ThinFilm_0603]

### Ports
ADC (out), DEN (in), DSEL (in), IN0 (in), IN1 (in), OUT0 (out), OUT1 (out), VS (in)

### Nets
GND: C24.1 C26.1 C27.2 C28.2 D10.1(Anode) R32.1 R33.1
DEN: Q6.3(DEN) R28.2
DSEL: Q6.5(DSEL) R29.2
IN0: Q6.2(IN0) R26.2
IN1: Q6.6(IN1) R27.2
IS ADC: Q6.4(IS) R31.2 R32.2
OUT0: C28.1 Q6.13(OUT0) ; port OUT0
OUT1: C27.1 Q6.9(OUT1) ; port OUT1
PROFET ADC: C26.2 R30.1 ; port ADC
PROFET DEN: R28.1 ; port DEN
PROFET DSEL: R29.1 ; port DSEL
PROFET IN0: R26.1 ; port IN0
PROFET IN1: R27.1 ; port IN1
VS: C24.2 C25.2 Q6.15(VS) ; port VS
NetC25_1: C25.1 Q6.1(GND) R33.2
NetD10_2: D10.2(Cathode) R30.2 R31.1

Not connected (* = marked no-connect by the designer): Q6 7(NC) 8(OUT1) 10(OUT1) 11(NC) 12(OUT0) 14(OUT0)

### Channels
AMS Contactor Interface/PROFET 1: designators end in _PROFET_1; ports ADC=PFET1 ADC DEN=PFET1 DEN DSEL=PFET1 DSEL IN0=PFET1 IN0 IN1=PFET1 IN1 OUT0=CONTACTOR INTERFACE.HVA+ OUT1=CONTACTOR INTERFACE.HVB+ VS=VS
AMS Contactor Interface/PROFET 3: designators end in _PROFET_3; ports ADC=PFET3 ADC DEN=PFET3 DEN DSEL=PFET3 DSEL IN0=PFET3 IN0 IN1=PFET3 IN1 OUT0=CONTACTOR INTERFACE.PRECHG OUT1=OUT1_PROFET 3 VS=VS
AMS Contactor Interface/PROFET 2: designators end in _PROFET_2; ports ADC=PFET2 ADC DEN=PFET2 DEN DSEL=PFET2 DSEL IN0=PFET2 IN0 IN1=PFET2 IN1 OUT0=CONTACTOR INTERFACE.HVA- OUT1=CONTACTOR INTERFACE.HVB- VS=VS

### Notes on the sheet
- Revision History:
- Sheet Title:
- Rev
- Date
- Description
- Project:
- Size:
- Drawn By:
- A3
- Number:
- Revision:
- Sheet
- Version:
- of
- QUT Motorsport
- O-120, Gardens Point
- 2 George Street
- Brisbane, QLD 4000
- Australia
- Print Date:
- Print Time:
- File Name:

### Library data of the parts
C24 = 100nF 50V 5% X7R 0603: as C1 on sheet AMU-S02-V00-PSU3V3
C25 = 47nF 50V 10% X7R 0603: 0.047µF ±10% 50V Ceramic Capacitor X7R 0603 (1608 Metric); ComponentLink1Description: Digikey; ComponentLink1URL: https://www.digikey.com.au/product-detail/en/kemet/C0603C473K5RACTU/399-7933-1-ND/3471656; ComponentLink2Description: Datasheet; ComponentLink2URL: https://content.kemet.com/datasheets/KEM_C1002_X7R_SMD.pdf
C26 = 220pF 50V 5% 0603: 220pF ±5% 50V Ceramic Capacitor C0G, NP0 0603 (1608 Metric); ComponentLink1Description: Digikey; ComponentLink1URL: https://www.digikey.com.au/product-detail/en/kemet/C0603C221J5GACTU/399-1066-1-ND/411341; ComponentLink2Description: Datasheet; ComponentLink2URL: https://content.kemet.com/datasheets/KEM_C1003_C0G_SMD.pdf
C27 C28 = 10nF 50V 20% X7R 0603: 10000pF ±20% 50V Ceramic Capacitor X7R 0603 (1608 Metric); ComponentLink1Description: Digikey; ComponentLink1URL: https://www.digikey.com.au/product-detail/en/kemet/C0603C103M5RACTU/399-7842-1-ND/3471565; ComponentLink2Description: Datasheet; ComponentLink2URL: https://content.kemet.com/datasheets/KEM_C1002_X7R_SMD.pdf
D10 = MM3Z3V3B: Zener Diode 3.3V 200mW ±2% Surface Mount SOD-323F; Manufacturer: ON Semiconductor; MPN: MM3Z56VB; ComponentLink1Description: Digikey; ComponentLink1URL: https://www.digikey.com.au/product-detail/en/on-semiconductor/MM3Z3V3B/MM3Z3V3BCT-ND/1626881; ComponentLink2Description: Datasheet; ComponentLink2URL: https://www.onsemi.com/pub/Collateral/MM3Z9V1B-D.pdf
R26-R31 = 4k7 5% 0603: Resistor, SMD, 4k7, 0.1W, 5%, 0603
R32 = 1k2 5% 0603: Resistor, SMD, 1k2, 0.1W, 5%, 0603
R33 = 47R 5% 0603: Resistor, SMD, 47R, 0.1W, 5%, 0603
Q6 = BTS7080-2EPA: ComponentLink1Description: Infineon; ComponentLink1URL: https://www.infineon.com/cms/en/product/power/smart-low-side-high-side-switches/high-side-switches/profet-plus-2-12v-automotive-smart-high-side-switch/bts7080-2epa/; ComponentLink2Description: Datasheet; ComponentLink2URL: https://www.infineon.com/dgdl/Infineon-BTS7080-2EPA-DataSheet-v01_06-EN.pdf?fileId=5546d4625e763904015e941bf21e2dbe

## Sheet AMU-S04-V00-Microcontroller.SchDoc: AMU Microcontroller
size A3; DrawnBy: Thomas Benedetti; DocumentNumber: 4; Revision: 01; SheetNumber: 5; SheetTotal: 25; Version: 01; Project: AMU 2020; PageSetup: Record=PageOptions|CenterHorizontal=True|CenterVertical=True|PrintScale=0.97|XCorrection=1.00|YCorrection=1.00|PrintKind=0|BorderSize=5000000|LeftOffset=0|BottomOffset=0|Orientation=2|PaperLength=1000|PaperWidth=1000|Scale=100|PaperSource=7|PrintQuality=-4|MediaType=1|DitherType=10|PaperKind=A4|PrintScaleMode=1
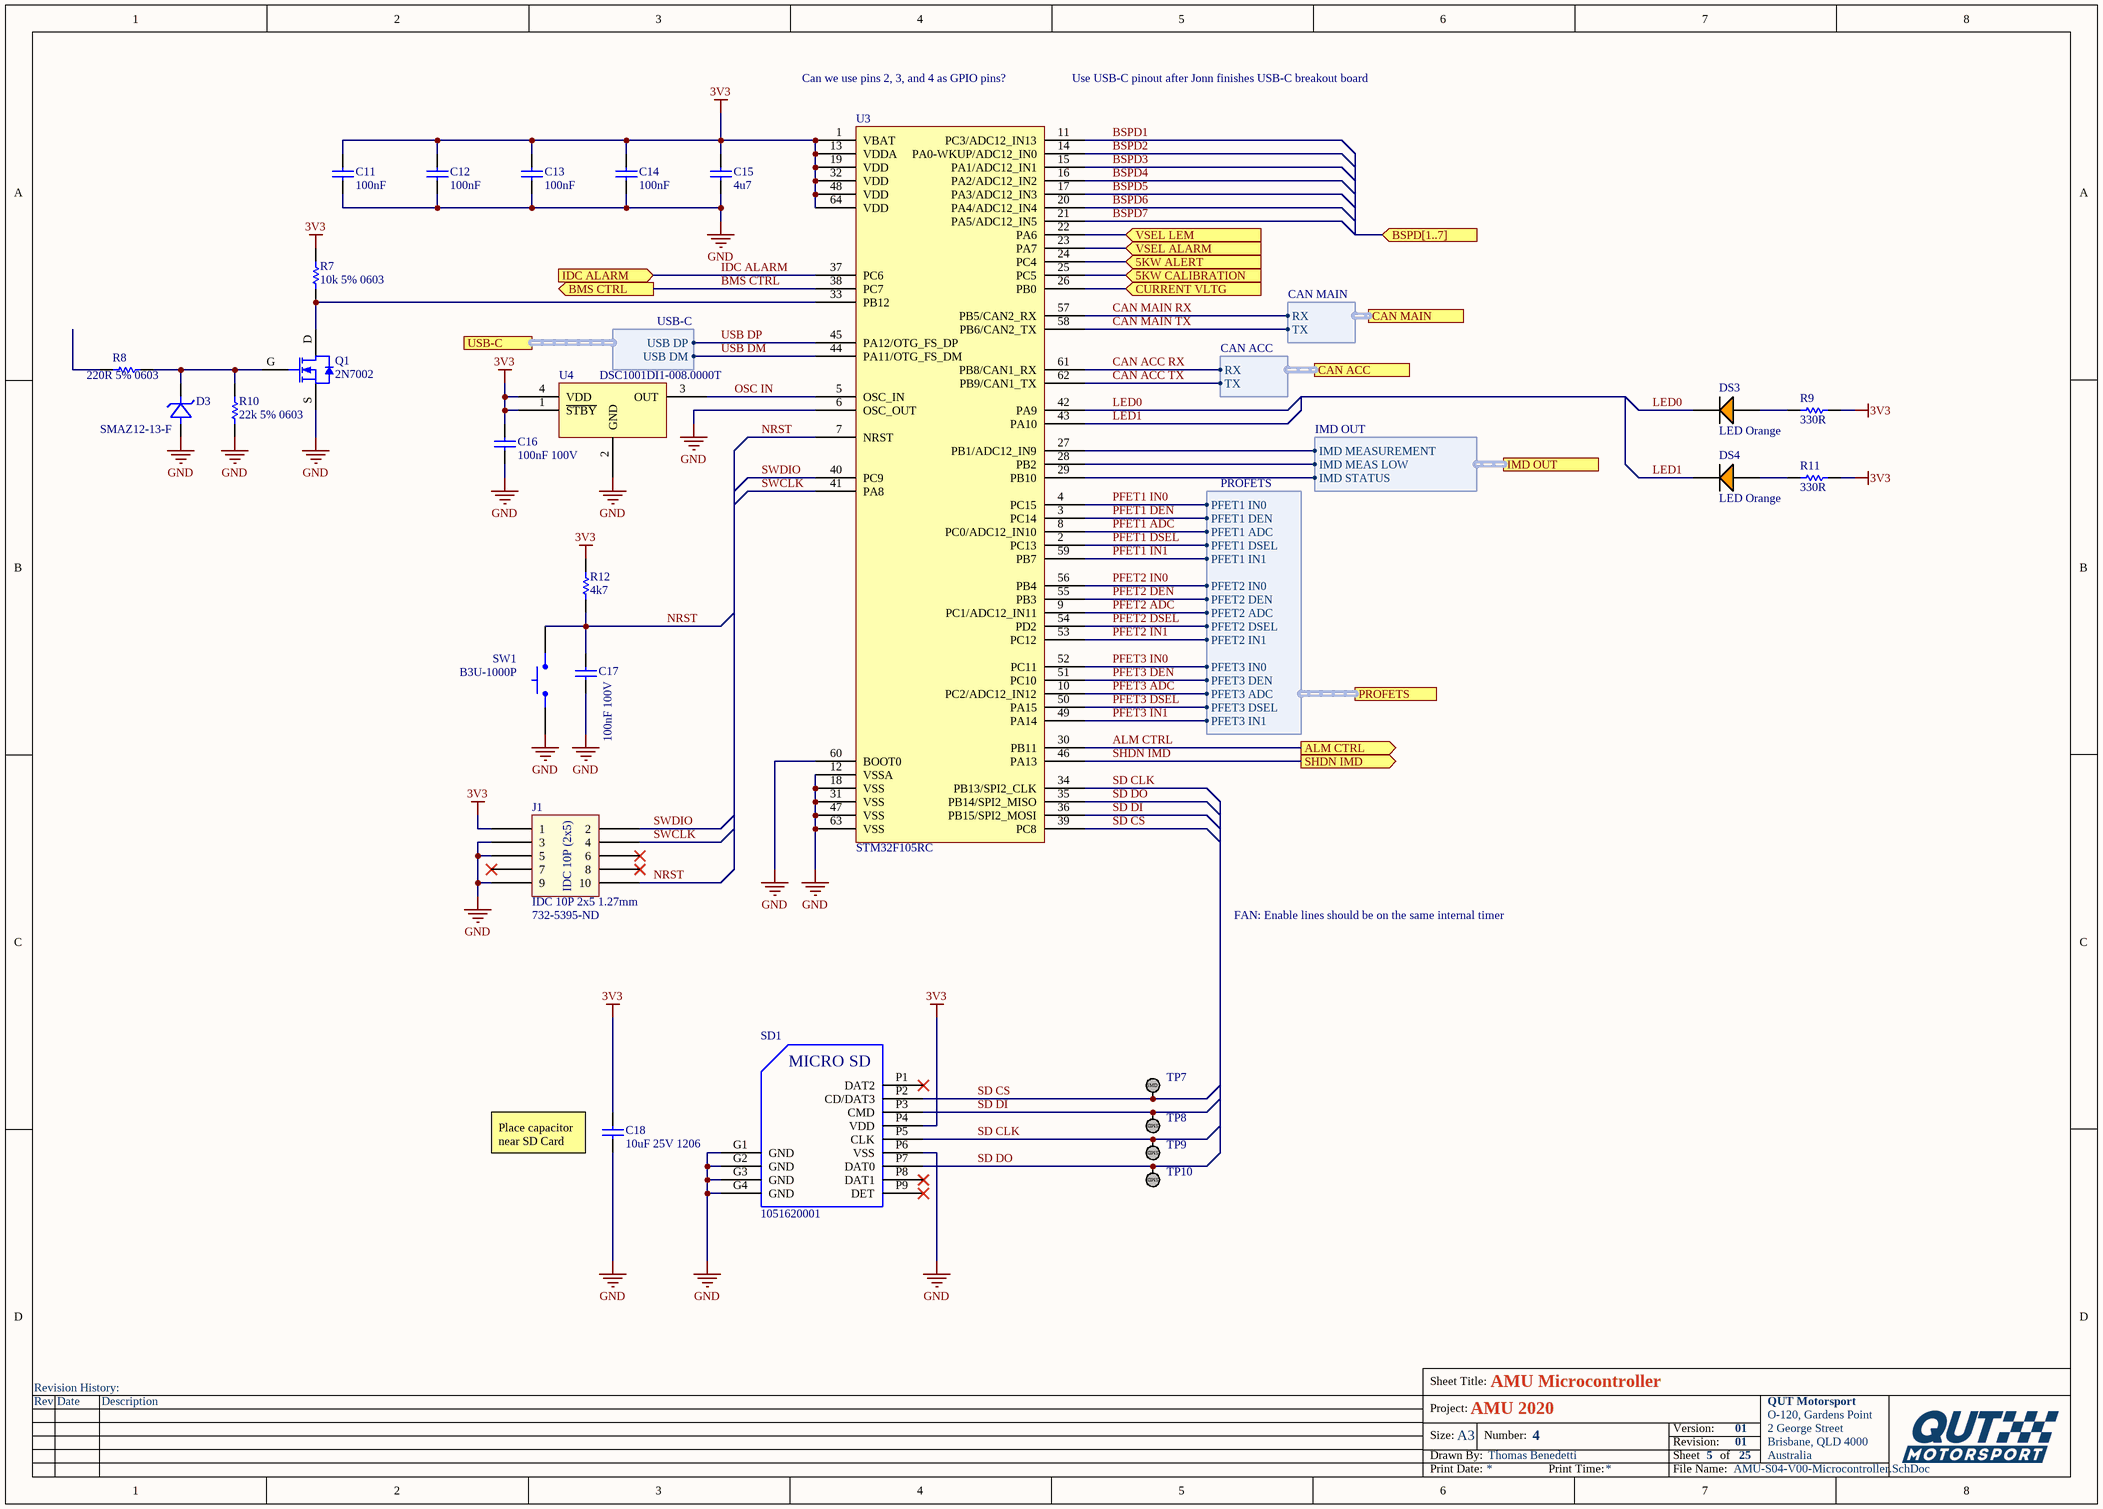
[diagram p6: AMU-S04-V00-Microcontroller.SchDoc]

### Parts
C11  100nF  [Cap_Ceramic_0603]
C12  100nF  [Cap_Ceramic_0603]
C13  100nF  [Cap_Ceramic_0603]
C14  100nF  [Cap_Ceramic_0603]
C15  4u7  [Cap_Ceramic_0603]
C16  100nF 100V  [Cap_Ceramic_0603]
C17  100nF 100V  [Cap_Ceramic_0603]
C18  10uF 25V 1206  [Cap_Ceramic_1206]
D3  SMAZ12-13-F  [SMA]
DS3  LED Orange  [LED ORANGE 0603]
DS4  LED Orange  [LED ORANGE 0603]
J1  IDC 10P 2x5 1.27mm  [IDC 1.27MM 10P]
Q1  2N7002  [SOT23-3]
R7  10k 5% 0603  [Res_ThinFilm_0603]
R8  220R 5% 0603  [Res_ThinFilm_0603]
R9  330R  [Res_ThinFilm_0603]
R10  22k 5% 0603  [Res_ThinFilm_0603]
R11  330R  [Res_ThinFilm_0603]
R12  4k7  [Res_ThinFilm_0603]
SD1  1051620001  [1051620001]
SW1  B3U-1000P  [BTN B3U-1000P]
TP7  TestPoint_SMD  [TestPointSMD]  (value not drawn)
TP8  TestPoint_SMD  [TestPointSMD]  (value not drawn)
TP9  TestPoint_SMD  [TestPointSMD]  (value not drawn)
TP10  TestPoint_SMD  [TestPointSMD]  (value not drawn)
U3  STM32F105RC  [STM32F105RC]
U4  DSC1001DI1-008.0000T  [DSC1001DI1-008.0000TCT-ND]

### Ports
5KW ALERT (in), 5KW CALIBRATION (in), ALM CTRL (out), BMS CTRL (out), BSPD[1..7] (in), CAN ACC (harness CAN ACC), CAN MAIN (harness CAN MAIN), CURRENT VLTG (in), IDC ALARM (in), IMD OUT (harness IMD OUT), PROFETS (harness PROFETS), SHDN IMD (out), USB-C (harness USB-C), VSEL ALARM (in), VSEL LEM (in)

### Harnesses
PROFETS: PFET3 DEN, PFET3 ADC, PFET3 DSEL, PFET2 DEN, PFET2 DSEL, PFET2 ADC, PFET1 DEN, PFET1 ADC, PFET1 DSEL, PFET1 IN0, PFET2 IN0, PFET3 IN0, PFET1 IN1, PFET2 IN1, PFET3 IN1
CAN MAIN: TX, RX
IMD OUT: IMD MEASUREMENT, IMD MEAS LOW, IMD STATUS
CAN ACC: RX, TX
USB-C: USB DP, USB DM

### Nets
3V3: C11.2 C12.2 C13.2 C14.2 C15.2 C16.2 C18.2 J1.1 R7.1 R9.2 R11.2 R12.2 SD1.P4(VDD) U3.1(VBAT) U3.13(VDDA) U3.19(VDD) U3.32(VDD) U3.48(VDD) U3.64(VDD) U4.1(~{STBY}) U4.4(VDD)
GND: C11.1 C12.1 C13.1 C14.1 C15.1 C16.1 C17.1 C18.1 D3.A(Anode) J1.3 J1.5 J1.9 Q1.S R10.1 SD1.G1(GND) SD1.G2(GND) SD1.G3(GND) SD1.G4(GND) SD1.P6(VSS) SW1.1 U3.6(OSC_OUT) U3.12(VSSA) U3.18(VSS) U3.31(VSS) U3.47(VSS) U3.60(BOOT0) U3.63(VSS) U4.2(GND)
5kW ALERT: U3.24(PC4) ; port 5KW ALERT
5kW CALIBRATION: U3.25(PC5) ; port 5KW CALIBRATION
ALM CTRL: U3.30(PB11) ; port ALM CTRL
BMS CTRL: U3.38(PC7) ; port BMS CTRL
BSPD1: U3.11(PC3/ADC12_IN13)
BSPD2: U3.14(PA0-WKUP/ADC12_IN0)
BSPD3: U3.15(PA1/ADC12_IN1)
BSPD4: U3.16(PA2/ADC12_IN2)
BSPD5: U3.17(PA3/ADC12_IN3)
BSPD6: U3.20(PA4/ADC12_IN4)
BSPD7: U3.21(PA5/ADC12_IN5)
CAN ACC RX: U3.61(PB8/CAN1_RX) ; port CAN ACC.RX
CAN ACC TX: U3.62(PB9/CAN1_TX) ; port CAN ACC.TX
CAN MAIN RX: U3.57(PB5/CAN2_RX) ; port CAN MAIN.RX
CAN MAIN TX: U3.58(PB6/CAN2_TX) ; port CAN MAIN.TX
CURRENT VLTG: U3.26(PB0) ; port CURRENT VLTG
IDC ALARM: U3.37(PC6) ; port IDC ALARM
IMD MLV: U3.28(PB2) ; port IMD OUT.IMD MEAS LOW
IMD MV: U3.27(PB1/ADC12_IN9) ; port IMD OUT.IMD MEASUREMENT
LED0: DS3.2(C) U3.42(PA9)
LED1: DS4.2(C) U3.43(PA10)
NRST: C17.2 J1.10 R12.1 SW1.2 U3.7(NRST)
OSC IN: U3.5(OSC_IN) U4.3(OUT)
PFET1 ADC: U3.8(PC0/ADC12_IN10) ; port PROFETS.PFET1 ADC
PFET1 DEN: U3.3(PC14) ; port PROFETS.PFET1 DEN
PFET1 DSEL: U3.2(PC13) ; port PROFETS.PFET1 DSEL
PFET1 IN0: U3.4(PC15) ; port PROFETS.PFET1 IN0
PFET1 IN1: U3.59(PB7) ; port PROFETS.PFET1 IN1
PFET2 ADC: U3.9(PC1/ADC12_IN11) ; port PROFETS.PFET2 ADC
PFET2 DEN: U3.55(PB3) ; port PROFETS.PFET2 DEN
PFET2 DSEL: U3.54(PD2) ; port PROFETS.PFET2 DSEL
PFET2 IN0: U3.56(PB4) ; port PROFETS.PFET2 IN0
PFET2 IN1: U3.53(PC12) ; port PROFETS.PFET2 IN1
PFET3 ADC: U3.10(PC2/ADC12_IN12) ; port PROFETS.PFET3 ADC
PFET3 DEN: U3.51(PC10) ; port PROFETS.PFET3 DEN
PFET3 DSEL: U3.50(PA15) ; port PROFETS.PFET3 DSEL
PFET3 IN0: U3.52(PC11) ; port PROFETS.PFET3 IN0
PFET3 IN1: U3.49(PA14) ; port PROFETS.PFET3 IN1
SD CLK: SD1.P5(CLK) TP9.1 U3.34(PB13/SPI2_CLK)
SD CS: SD1.P2(CD/DAT3) TP7.1 U3.39(PC8)
SD DI: SD1.P3(CMD) TP8.1 U3.36(PB15/SPI2_MOSI)
SD DO: SD1.P7(DAT0) TP10.1 U3.35(PB14/SPI2_MISO)
SHDN IMD: U3.29(PB10) U3.46(PA13) ; port SHDN IMD, port IMD OUT.IMD STATUS  [project net IMD OUT.IMD STATUS]
SWCLK: J1.4 U3.41(PA8)
SWDIO: J1.2 U3.40(PC9)
USB DM: U3.44(PA11/OTG_FS_DM) ; port USB-C.USB DM
USB DP: U3.45(PA12/OTG_FS_DP) ; port USB-C.USB DP
NetD3_K: D3.K(Cathode) Q1.G R8.2 R10.2
NetDS3_1: DS3.1(A) R9.1
NetDS4_1: DS4.1(A) R11.1
NetQ1_D: Q1.D R7.2 U3.33(PB12)
NetR54_1: U3.22(PA6) ; port VSEL LEM
NetR67_1: U3.23(PA7) ; port VSEL ALARM

Not connected (* = marked no-connect by the designer): J1 6* 7* 8*; R8 1; SD1 P1(DAT2)* P8(DAT1)* P9(DET)*

### Notes on the sheet
- Can we use pins 2, 3, and 4 as GPIO pins?
- Use USB-C pinout after Jonn finishes USB-C breakout board
- (near J1) 732-5395-ND
- FAN: Enable lines should be on the same internal timer
- (near C18) Place capacitor near SD Card
- Revision History:
- Sheet Title:
- Rev
- Date
- Description
- Project:
- Size:
- Drawn By:
- A3
- Number:
- Revision:
- Sheet
- Version:
- of
- QUT Motorsport
- O-120, Gardens Point
- 2 George Street
- Brisbane, QLD 4000
- Australia
- Print Date:
- Print Time:
- File Name:
- (in symbol 1051620001) MICRO SD
- (in symbol IDC 10P 2x5 1.27mm) IDC 10P (2x5)
- (in symbol TestPoint_SMD) SMD

### Library data of the parts
C11-C14 = 100nF 50V 5% X7R 0603: as C1 on sheet AMU-S02-V00-PSU3V3
C15 = 4u7 50V 5% X7R 0603: Capacitor, Ceramic, SMD, 4u7, 50V, 5%, X7R, 0603
C16 C17 = 100nF 100V 5% X7R 0603: as C6 on sheet AMU-S03-V00-PSU3V5
C18 = 10uF 25V 10% X7R 1206: Capacitor, Ceramic, SMD, 10uF, 25V, 10%, X7R, 1206
D3 = SMAZ12-13-F: Zener Diode 12V 1W ±5% Surface Mount SMA; ComponentLink1Description: Datasheet:; ComponentLink1URL: https://www.diodes.com/assets/Datasheets/ds18015.pdf
DS3 DS4 = LED ORANGE 0603
R7 = 10k 5% 0603: Resistor, SMD, 10k, 0.1W, 5%, 0603
R8 = 220R 5% 0603: Resistor, SMD, 220R, 0.1W, 5%, 0603
R9 R11 = 330R 5% 0603: Resistor, SMD, 330R, 0.1W, 5%, 0603
R10 = 22k 5% 0603: Resistor, SMD, 22k, 0.1W, 5%, 0603
R12 = 4k7 5% 0603: Resistor, SMD, 4k7, 0.1W, 5%, 0603
SD1 = 1051620001: 9 (8 + 1) Position Card Connector microSD™ Surface Mount, Right Angle Gold; ComponentLink1Description: Digikey; ComponentLink1URL: https://www.digikey.com.au/product-detail/en/molex/1051620001/WM14405CT-ND/6133135; ComponentLink2Description: Datasheet; ComponentLink2URL: https://www.molex.com/pdm_docs/sd/1051620001_sd.pdf
SW1 = BTN B3U-1000P: Omron B3U-1000P Ultra Miniture Switch; ComponentLink1Description: LCSC; ComponentLink1URL: https://lcsc.com/product-detail/Tactile-Switches_BRIGHT-TSA063G50-250_C294565.html
U3 = STM32F105RC: ARM® Cortex®-M3 STM32F1 Microcontroller IC 32-Bit 72MHz 256KB (256K x 8) FLASH 64-LQFP (10x10); ComponentLink1Description: Digikey; ComponentLink1URL: https://www.digikey.com.au/product-detail/en/stmicroelectronics/STM32F105RCT6TR/497-17397-1-ND/8024118; ComponentLink2Description: Datasheet; ComponentLink2URL: https://www.st.com/content/ccc/resource/technical/document/datasheet/e4/f3/1a/89/5a/02/46/ae/CD00220364.pdf/files/CD00220364.pdf/jcr:content/translations/en.CD00220364.pdf
U4 = DSC1001DI1-008.0000T: on 8MHz XO (Standard) CMOS Oscillator 1.8 ~ 3.3V Standby (Power Down) 4-SMD, No Lead

## Sheet AMU-S23-V00-CURRENTPSU5V.SchDoc: Power Supply (9-25V to 5V @ 0.1-0.3A)
size A3; DrawnBy: Jonn Dillon; DocumentNumber: 9; Revision: 01; SheetNumber: 21; SheetTotal: 25; Version: 01; Project: Shutdown Current Board 2020; PageSetup: Record=PageOptions|CenterHorizontal=True|CenterVertical=True|PrintScale=0.97|XCorrection=1.00|YCorrection=1.00|PrintKind=0|BorderSize=5000000|LeftOffset=0|BottomOffset=0|Orientation=2|PaperLength=1000|PaperWidth=1000|Scale=100|PaperSource=7|PrintQuality=-4|MediaType=1|DitherType=10|PaperKind=A4|PrintScaleMode=1
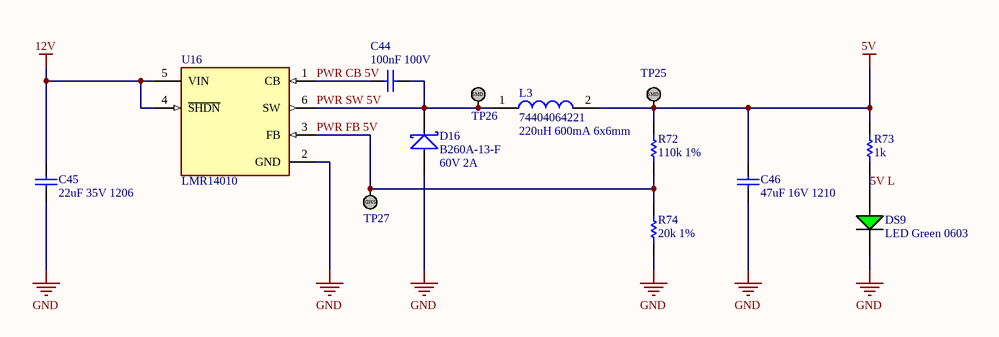
[diagram p7: AMU-S23-V00-CURRENTPSU5V.SchDoc]

### Parts
C44  100nF 100V  [Cap_Ceramic_0603]
C45  22uF 35V 1206  [Cap_Ceramic_1206]
C46  47uF 16V 1210  [Cap_Ceramic_1210]
D16  B260A-13-F  [SMA]
DS9  LED Green 0603  [LED GREEN 0603]
L3  74404064221  [Inductor_6x6mm]
R72  110k 1%  [Res_ThinFilm_0603]
R73  1k  [Res_ThinFilm_0603]
R74  20k 1%  [Res_ThinFilm_0603]
TP25  TestPoint_SMD  [TestPointSMD]  (value not drawn)
TP26  TestPoint_SMD  [TestPointSMD]  (value not drawn)
TP27  TestPoint_SMD  [TestPointSMD]  (value not drawn)
U16  LMR14010  [LMR14010]

### Nets
5V: C46.2 L3.2 R72.2 R73.2 TP25.1
12V: C45.2 U16.4(~{SHDN}) U16.5(VIN)  [project net HV ON]
GND: C45.1 C46.1 D16.A DS9.2(C) R74.1 U16.2(GND)
5V L: DS9.1(A) R73.1
PWR CB 5V: C44.1 U16.1(CB)
PWR FB 5V: R72.1 R74.2 TP27.1 U16.3(FB)
PWR SW 5V: C44.2 D16.K L3.1 TP26.1 U16.6(SW)

### Notes on the sheet
- (near L3) 220uH 600mA 6x6mm
- (near D16) 60V 2A
- Revision History:
- Sheet Title:
- Rev
- Date
- Description
- Project:
- Size:
- Drawn By:
- A3
- Number:
- Revision:
- Sheet
- Version:
- of
- QUT Motorsport
- O-120, Gardens Point
- 2 George Street
- Brisbane, QLD 4000
- Australia
- Print Date:
- Print Time:
- File Name:
- (in symbol TestPoint_SMD) SMD

### Library data of the parts
C44 = 100nF 100V 5% X7R 0603: as C6 on sheet AMU-S03-V00-PSU3V5
C45 = 22uF 35V 10% X7R 1206: Capacitor, Ceramic, SMD, 22uF, 35V, 10%, X7R, 1206
C46 = 47uF 16V 10% X7R 1210: as C4 on sheet AMU-S02-V00-PSU3V3
D16 = B260A-13-F: as D1 on sheet AMU-S02-V00-PSU3V3
L3 = 74404064221: FIXED IND 220UH 660MA 850 MOHM; ComponentLink1Description: Digikey; ComponentLink1URL: https://www.digikey.com.au/product-detail/en/w%C3%BCrth-elektronik/74404064221/732-7261-1-ND/5353241; ComponentLink2Description: LCSC A; ComponentLink2URL: https://lcsc.com/product-detail/Power-Inductors_Sunlord-SWPA6045S221MT_C91047.html; ComponentLink3Description: LCSC B; ComponentLink3URL: https://lcsc.com/product-detail/Power-Inductors_SXN-Shun-Xiang-Nuo-Elec-SMNR6045-221MT_C467145.html
R72 = 111k 1% 0603: Resistor, SMD, 111k, 0.1W, 1%, 0603
R73 = 1k 5% 0603: Resistor, SMD, 1k, 0.1W, 5%, 0603
R74 = 20k 1% 0603: Resistor, SMD, 20k, 0.1W, 1%, 0603

## Sheet AMU-S07-V00-AMSShutdown.SchDoc: Alarm Relay
size A3; DrawnBy: Thomas Benedetti; DocumentNumber: 7; SheetNumber: 7; SheetTotal: 25; Version: 00; Project: AMU 2020; PageSetup: Record=PageOptions|CenterHorizontal=True|CenterVertical=True|PrintScale=0.97|XCorrection=1.00|YCorrection=1.00|PrintKind=0|BorderSize=5000000|LeftOffset=0|BottomOffset=0|Orientation=2|PaperLength=1000|PaperWidth=1000|Scale=100|PaperSource=7|PrintQuality=-4|MediaType=1|DitherType=10|PaperKind=A4|PrintScaleMode=1
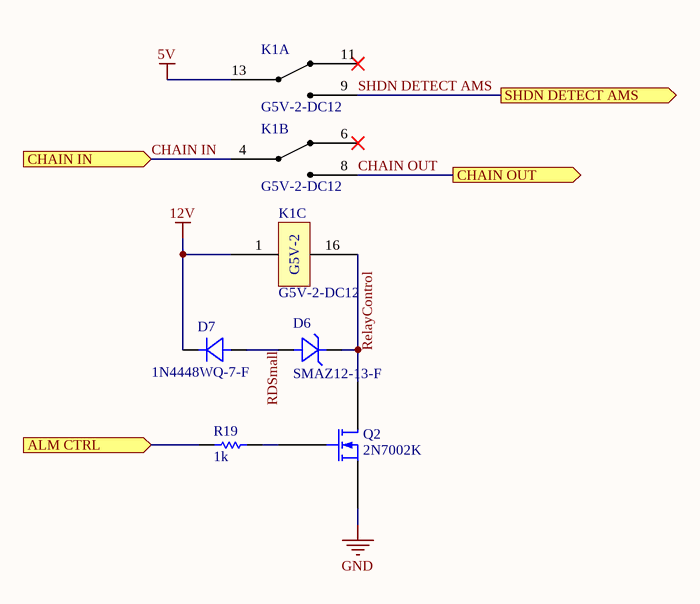
[diagram p8: AMU-S07-V00-AMSShutdown.SchDoc]

### Parts
D6  SMAZ12-13-F  [SMA]
D7  1N4448WQ-7-F  [SMA]
K1  G5V-2-DC12  [G5V-2]  (parts A,B,C of 3)
Q2  2N7002K  [SOT-23-3]
R19  1k  [Res_ThinFilm_0603]

### Ports
ALM CTRL (in), CHAIN IN (in), CHAIN OUT (out), SHDN DETECT AMS (out)

### Nets
5V: K1.13
12V: D7.K(Cathode) K1.1  [project net HV ON]
GND: Q2.S
ALM CTRL: R19.1 ; port ALM CTRL
CHAIN IN: K1.4 ; port CHAIN IN  [project net CHAIN BSPD-AMS]
CHAIN OUT: K1.8 ; port CHAIN OUT  [project net CHAIN AMS-IMD]
RDSmall: D6.A(Anode) D7.A(Anode)
RelayControl: D6.K(Cathode) K1.16 Q2.D
SHDN DETECT AMS: K1.9 ; port SHDN DETECT AMS
NetQ2_G: Q2.G R19.2

Not connected (* = marked no-connect by the designer): K1 6* 11*

### Notes on the sheet
- Revision History:
- Sheet Title:
- Rev
- Date
- Description
- Project:
- Size:
- Drawn By:
- A3
- Number:
- Revision:
- Sheet
- Version:
- of
- QUT Motorsport
- O-120, Gardens Point
- 2 George Street
- Brisbane, QLD 4000
- Australia
- Print Date:
- Print Time:
- File Name:
- (in symbol G5V-2-DC12, part C) G5V-2

### Library data of the parts
D6 = SMAZ12-13-F: as D8 on sheet AMU-S10-V00-AMSContactorInterface; ComponentLink1Description: Digikey; ComponentLink1URL: https://www.digikey.com.au/product-detail/en/diodes-incorporated/SMAZ12-13-F/SMAZ12-FDICT-ND/725073; ComponentLink2Description: Datasheet; ComponentLink2URL: https://www.diodes.com/assets/Datasheets/ds18015.pdf
D7 = 1N4448WQ-7-F: as D9 on sheet AMU-S10-V00-AMSContactorInterface; Parameter 1: *; Weight: 0.0276g; Category: Rectifier Diodes; Contact Plating: Tin,Matte; Forward Current: 150mA; Lead Free: Lead Free; Max Operating Temperature: 150°C; Max Repetitive Reverse Voltage (Vrrm): 75V; Max Reverse Voltage (DC): 75V; Min Operating Temperature: -55°C; Mount: Surface Mount; Number of Pins: 2; Package Quantity: 1; Packaging: Tape and Reel; Peak Reverse Current: 5uA; Radiation Hardening: No; REACH SVHC: No SVHC; Reverse Recovery Time: 4ns; Height: 1mm; Length: 1.8mm; Reverse Voltage: 75V; Width: 1.35mm
K1 = G5V-2-DC12: General Purpose Relay DPDT (2 Form C) Through Hole, 12V, 2A
Q2 = 2N7002K: N-Channel 60V 300mA (Ta) 350mW (Ta) Surface Mount SOT-23 (TO-236AB)
R19 = 1k 5% 0603: Resistor, SMD, 1k, 0.1W, 5%, 0603

## Sheet AMU-S26-V00-DAUGHTERShutdown.SchDoc: Shutdown Chain
size A3; Date: 10/07/2020; DrawnBy: Alikhan Hassan; DocumentNumber: 5; Revision: 00; SheetNumber: 22; SheetTotal: 25; Project: IMD Daughter Board 2020; Version: 01
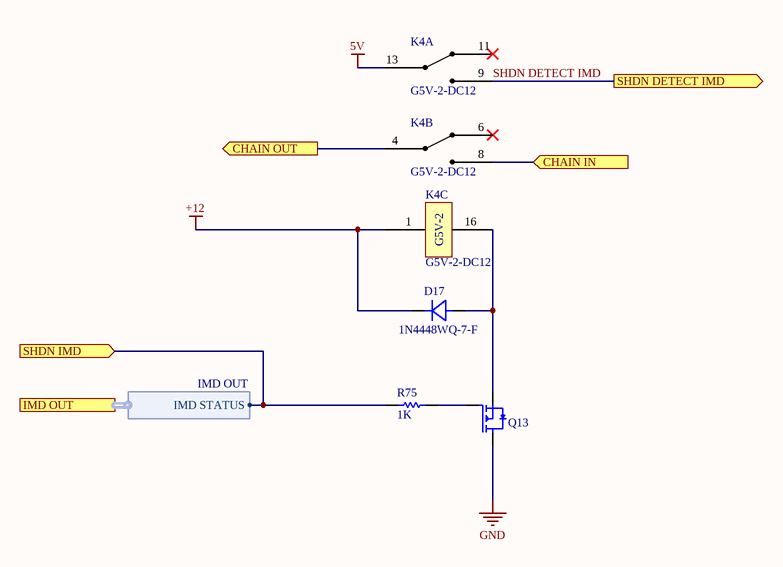
[diagram p9: AMU-S26-V00-DAUGHTERShutdown.SchDoc]

### Parts
D17  1N4448WQ-7-F  [SMA]
K4  G5V-2-DC12  [G5V-2]  (parts A,B,C of 3)
Q13  (no value)  [PMV15UNEAR]
R75  1K  [Res_ThinFilm_0603]

### Ports
CHAIN IN (in), CHAIN OUT (out), IMD OUT (harness IMD OUT), SHDN DETECT IMD (out), SHDN IMD (in)

### Harnesses
IMD OUT: IMD STATUS

### Nets
5V: K4.13
+12: D17.K(Cathode) K4.1
GND: Q13.D(Drain)
CHAIN AMS-IMD: K4.8 ; port CHAIN IN
CHAIN OUT: K4.4 ; port CHAIN OUT
IMD OUT.IMD STATUS: R75.1 ; port SHDN IMD, port IMD OUT.IMD STATUS
SHDN DETECT IMD: K4.9 ; port SHDN DETECT IMD
NetD17_A: D17.A(Anode) K4.16 Q13.S(Source)
NetQ13_G: Q13.G(Gate) R75.2

Not connected (* = marked no-connect by the designer): K4 6* 11*

### Notes on the sheet
- Revision History:
- Sheet Title:
- Rev
- Date
- Description
- Project:
- Size:
- Drawn By:
- A3
- Number:
- Revision:
- Sheet
- Version:
- of
- QUT Motorsport
- O-120, Gardens Point
- 2 George Street
- Brisbane, QLD 4000
- Australia
- Print Date:
- Print Time:
- File Name:
- (in symbol G5V-2-DC12, part C) G5V-2

### Library data of the parts
D17 = 1N4448WQ-7-F: as D9 on sheet AMU-S10-V00-AMSContactorInterface; Parameter 1: *; Weight: 0.0276g; Category: Rectifier Diodes; Contact Plating: Tin,Matte; Forward Current: 150mA; Lead Free: Lead Free; Max Operating Temperature: 150°C; Max Repetitive Reverse Voltage (Vrrm): 75V; Max Reverse Voltage (DC): 75V; Min Operating Temperature: -55°C; Mount: Surface Mount; Number of Pins: 2; Package Quantity: 1; Packaging: Tape and Reel; Peak Reverse Current: 5uA; Radiation Hardening: No; REACH SVHC: No SVHC; Reverse Recovery Time: 4ns; Height: 1mm; Length: 1.8mm; Reverse Voltage: 75V; Width: 1.35mm
K4 = G5V-2-DC12: as K1 on sheet AMU-S07-V00-AMSShutdown
Q13 = PMV15UNEAR: MOSFET N-CH, 20V, SOT23; Manufacturer: Nexperia
R75 = 1k 5% 0603: Resistor, SMD, 1k, 0.1W, 5%, 0603